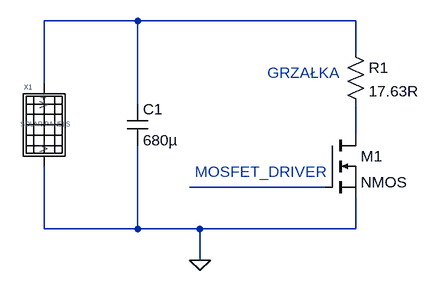
[diagram p0: schematic thesis_MPPT_photo.asc]
thesis_MPPT_photo.asc, the LTspice schematic file:
Version 4
SHEET 1 880 680
WIRE 160 112 16 112
WIRE 496 112 160 112
WIRE 496 160 496 112
WIRE 16 208 16 112
WIRE 160 240 160 112
WIRE 496 288 496 240
WIRE 448 368 240 368
WIRE 16 432 16 336
WIRE 160 432 160 304
WIRE 160 432 16 432
WIRE 256 432 160 432
WIRE 496 432 496 384
WIRE 496 432 256 432
WIRE 256 480 256 432
FLAG 256 480 0
SYMBOL EC370M-6-120FB_370_Wp 16 272 R0
SYMATTR InstName X1
SYMBOL res 480 144 R0
SYMATTR InstName R1
SYMATTR Value 17.63R
SYMBOL nmos 448 288 R0
SYMATTR InstName M1
SYMBOL cap 144 240 R0
SYMATTR InstName C1
SYMATTR Value 680µ
TEXT 248 344 Left 2 ;MOSFET_DRIVER
TEXT 360 192 Left 2 ;GRZAŁKA

The netlist it stands for:
* thesis_MPPT_photo.asc
XX1 0 N001 EC370M-6-120FB_370_Wp SOLAR_PANEL_CURRENT = {SOLAR_PANEL_CURRENT}  ; pins V- V+
R1 N001 N002 17.63R
M1 N002 N003 0 0 NMOS
C1 N001 0 680µ
.model NMOS NMOS
.model PMOS PMOS
.lib standard.mos
* MOSFET_DRIVER
* GRZAŁKA
.backanno
.end